# EAGLE design USB_Charger (EAGLE 7.5.0)
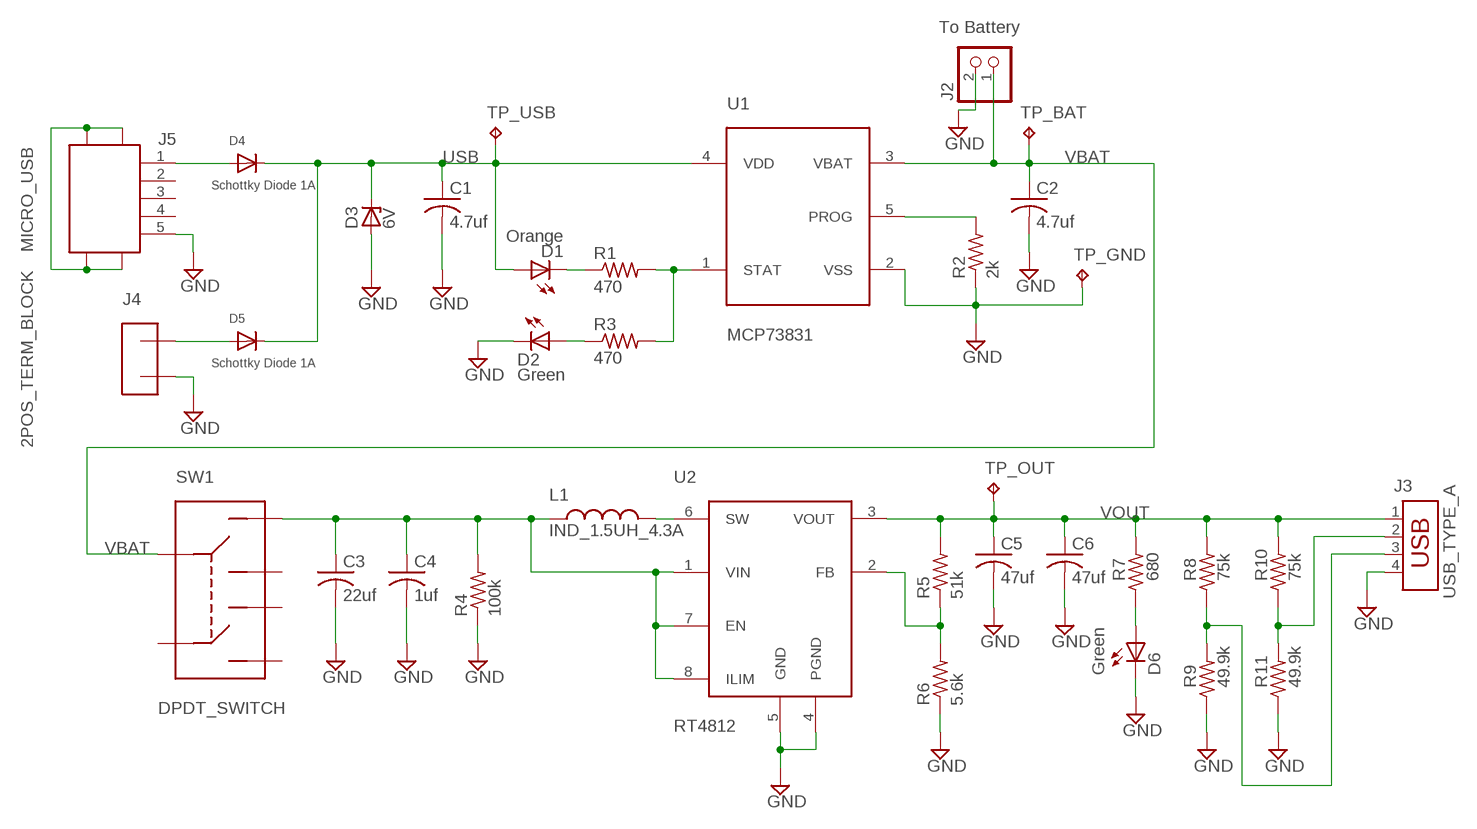
[diagram p0: schematic, sheet 1]

## Parts
C1  4.7uf  C-USC0805  [C0805]
C2  4.7uf  C-USC0805  [C0805]
C3  22uf  C-USC0805  [C0805]
C4  1uf  C-USC0805  [C0805]
C5  47uf  C-USC1210  [C1210]
C6  47uf  C-USC1210  [C1210]
D1  Orange  LEDCHIP-LED0805  [CHIP-LED0805]
D2  Green  LEDCHIP-LED0805  [CHIP-LED0805]
D3  6V  ZENER-DIODESMB  [SMB]
D4  Schottky Diode 1A  DIODESMA  [SMADIODE]
D5  Schottky Diode 1A  DIODESMA  [SMADIODE]
D6  Green  LEDCHIP-LED0805  [CHIP-LED0805]
J2  To Battery  JST_2PIN-THM-RA  [JST-PH-2-THM-RA]
J3  USB_TYPE_A  USB-787616  [USB]
J4  2POS_TERM_BLOCK  [2POS_5.08MM]
J5  MICRO_USB  [MICRO_USB]
L1  IND_1.5UH_4.3A  [IND_SMD]
R1  470  R-US_R0805  [R0805]
R2  2k  R-US_R0805  [R0805]
R3  470  R-US_R0805  [R0805]
R4  100k  R-US_R0805  [R0805]
R5  51k  R-US_R0805  [R0805]
R6  5.6k  R-US_R0805  [R0805]
R7  680  R-US_R0805  [R0805]
R8  75k  R-US_R0805  [R0805]
R9  49.9k  R-US_R0805  [R0805]
R10  75k  R-US_R0805  [R0805]
R11  49.9k  R-US_R0805  [R0805]
SW1  DPDT_SWITCH  [GF-126-0159]
TP_BAT  TPB1,27  [B1,27]
TP_GND  TPB1,27  [B1,27]
TP_OUT  TPB1,27  [B1,27]
TP_USB  TPB1,27  [B1,27]
U1  MCP73831  [SOT-23-5]
U2  RT4812  [TSOT-23-8]

## Nets
GND: C1.2 C2.2 C3.2 C4.2 C5.2 C6.2 D2.C D3.A D6.C J2.2 J3.4 J4.2 J5.5 R2.1 R4.1 R6.1 R9.1 R11.1 TP_GND.TP U1.2(VSS) U2.4(PGND) U2.5(GND)
IND_OUT: L1.2 U2.6(SW)
N$2: R5.1 R6.2 U2.2(FB)
N$3: D1.C R1.1
N$4: R1.2 R3.2 U1.1(STAT)
N$5: R2.2 U1.5(PROG)
N$6: D5.A J4.1
N$7: D2.A R3.1
N$10: D6.A R7.1
N$11: J3.3 R8.1 R9.2
N$12: J3.2 R10.1 R11.2
SW_OUT: C3.1 C4.1 L1.1 R4.2 SW1.1 U2.1(VIN) U2.7(EN) U2.8(ILIM)
USB: C1.1 D1.A D3.C D4.C D5.C TP_USB.TP U1.4(VDD)
USB_IN: D4.A J5.1
USB_SHD: J5.SH1 J5.SH2 J5.SH3 J5.SH4
VBAT: C2.1 J2.1 SW1.2 TP_BAT.TP U1.3(VBAT)
VOUT: C5.1 C6.1 J3.1 R5.2 R7.2 R8.2 R10.2 TP_OUT.TP U2.3(VOUT)
Unconnected: J5.2 J5.3 J5.4 SW1.3 SW1.4 SW1.5 SW1.6

## Library data of the parts
C1-C6 = rcl:C-US: CAPACITOR, American symbol
D1 D2 D6 = led:LED: LED OSRAM: - CHIPLED LG R971, LG N971, LY N971, LG Q971, LY Q971, LO R971, LY R971 LH N974, LH R974 LS Q976, LO Q976, LY Q976 LO Q996 - Hyper CHIPLED LW Q18S LB Q993, LB Q99A, LB R99A - SideLED LS A670, LO A670, LY A670, LG A670, LP A670 LB A673, LV A673, LT A673, LW A673 LH A674 LY A675 LS A676, LA A676, LO A676, LY A676, LW A676 LS A679, LY A679, LG A679 - Hyper Micro SIDELED® LS Y876, LA Y876, LO Y876, LY Y876 LT Y87S - SmartLED LW L88C, LW L88S LB L89C, LB L89S, LG L890 LS L89K, LO L89K, LY L89K LS L896, LA L896, LO L896, LY L896 - TOPLED LS T670, LO T670, LY T670, LG T670, LP T670 LSG T670, LSP T670, LSY T670, LOP T670, LYG T670 LG T671, LOG T671, LSG T671 LB T673, LV T673, LT T673, LW T673 LH T674 LS T676, LA T676, LO T676, LY T676, LB T676, LH T676, LSB T676, LW T676 LB T67C, LV T67C, LT T67C, LS T67K, LO T67K, LY T67K, LW E67C LS E67B, LA E67B, LO E67B, LY E67B, LB E67C, LV E67C, LT E67C LW T67C LS T679, LY T679, LG T679 LS T770, LO T770, LY T770, LG T770, LP T770 LB T773, LV T773, LT T773, LW T773 LH T774 LS E675, LA E675, LY E675, LS T675 LS T776, LA T776, LO T776, LY T776, LB T776 LHGB T686 LT T68C, LB T68C - Hyper Mini TOPLED® LB M676 - Mini TOPLED Santana® LG M470 LS M47K, LO M47K, LY M47K Source: http://www.osram.convergy.de LUXEON: - LUMILED® LXK2-PW12-R00, LXK2-PW12-S00, LXK2-PW14-U00, LXK2-PW14-V00 LXK2-PM12-R00, LXK2-PM12-S00, LXK2-PM14-U00 LXK2-PE12-Q00, LXK2-PE12-R00, LXK2-PE12-S00, LXK2-PE14-T00, LXK2-PE14-U00 LXK2-PB12-K00, LXK2-PB12-L00, LXK2-PB12-M00, LXK2-PB14-N00, LXK2-PB14-P00, LXK2-PB14-Q00 LXK2-PR12-L00, LXK2-PR12-M00, LXK2-PR14-Q00, LXK2-PR14-R00 LXK2-PD12-Q00, LXK2-PD12-R00, LXK2-PD12-S00 LXK2-PH12-R00, LXK2-PH12-S00 LXK2-PL12-P00, LXK2-PL12-Q00, LXK2-PL12-R00 Source: www.luxeon.com KINGBRIGHT: KA-3528ASYC Source: www.kingbright.com
D3 = diode:ZENER-DIODE: Z-Diode
D4 D5 = adafruit:DIODE: Diode SMADIODE - SMA Surface Mount Package 20V 1A Schottky Diode Digikey: 641-1014-6-ND DO-1N4148 - Through Hole Small Current Diode SOD-123 20V 1 A (.5mV Vf) Schottky Diode - Digikey: MBRX120TPMSCT-ND SOD-323 10V 570mA (.38mV Vf, 3ns) Schottky Diode - Digikey: ZLLS410CT-ND SOD-523 30V 30mA Schottky Diode (RB751S-40TE61) - Digikey: RB751S-40TE61CT-ND SOT23-R/W - SOT23 Package (R = Solder Paste/Reflow Ovens, W = Hand-Soldering) BAT54Film 40V 300mA - Digikey: 497-7162-1-ND
J2 = adafruit:JST_2PIN: JST 2-Pin Connectors of various flavors SMT-RA (S2B-PH-SM4) 4UConnector #17311 SMT (B2B-PH-SM4) THM-RA (S2B-PH) THM (B2B-PH)
J3 = con-amp:USB-787616: AMP connector
J4 = USB_Charger:2POS_TERM_BLOCK: Digikey Part# ED1817-ND, Female Connector Part# ED2908-ND
J5 = USB_Charger:MICRO_USB: Digikey Part# 609-4618-1-ND
L1 = USB_Charger:IND_1.5UH_4.3A: Digikey Part# 732-5514-1-ND
R1-R11 = rcl:R-US_: RESISTOR, American symbol
SW1 = USB_Charger:DPDT_SWITCH
TP_BAT TP_GND TP_OUT TP_USB = testpad:TP: Test pad
U1 = USB_Charger:MCP73831
U2 = USB_Charger:RT4812: Digikey Part# RT4812GJ8FCT-ND

## Board
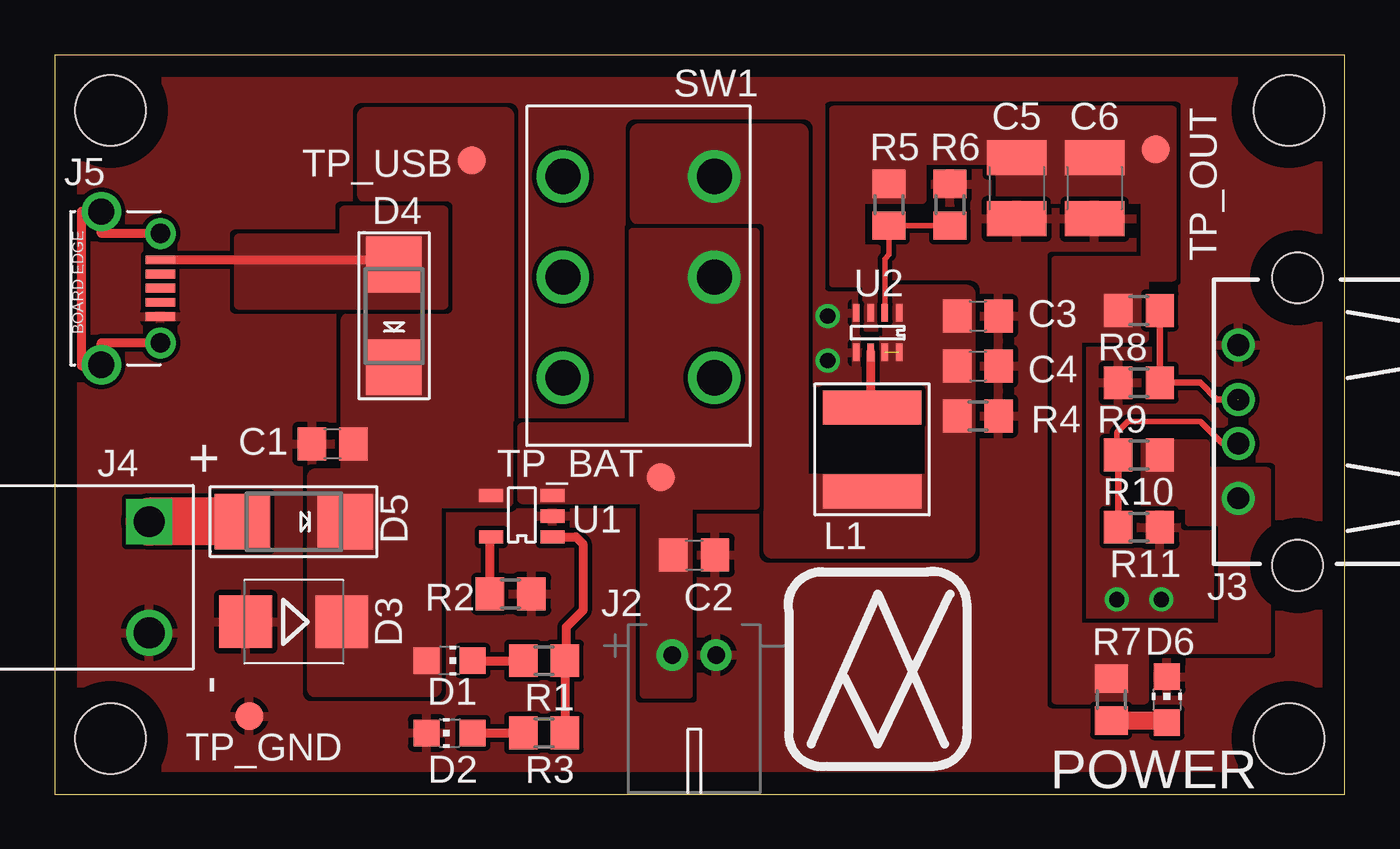
[diagram p1: board, top side]
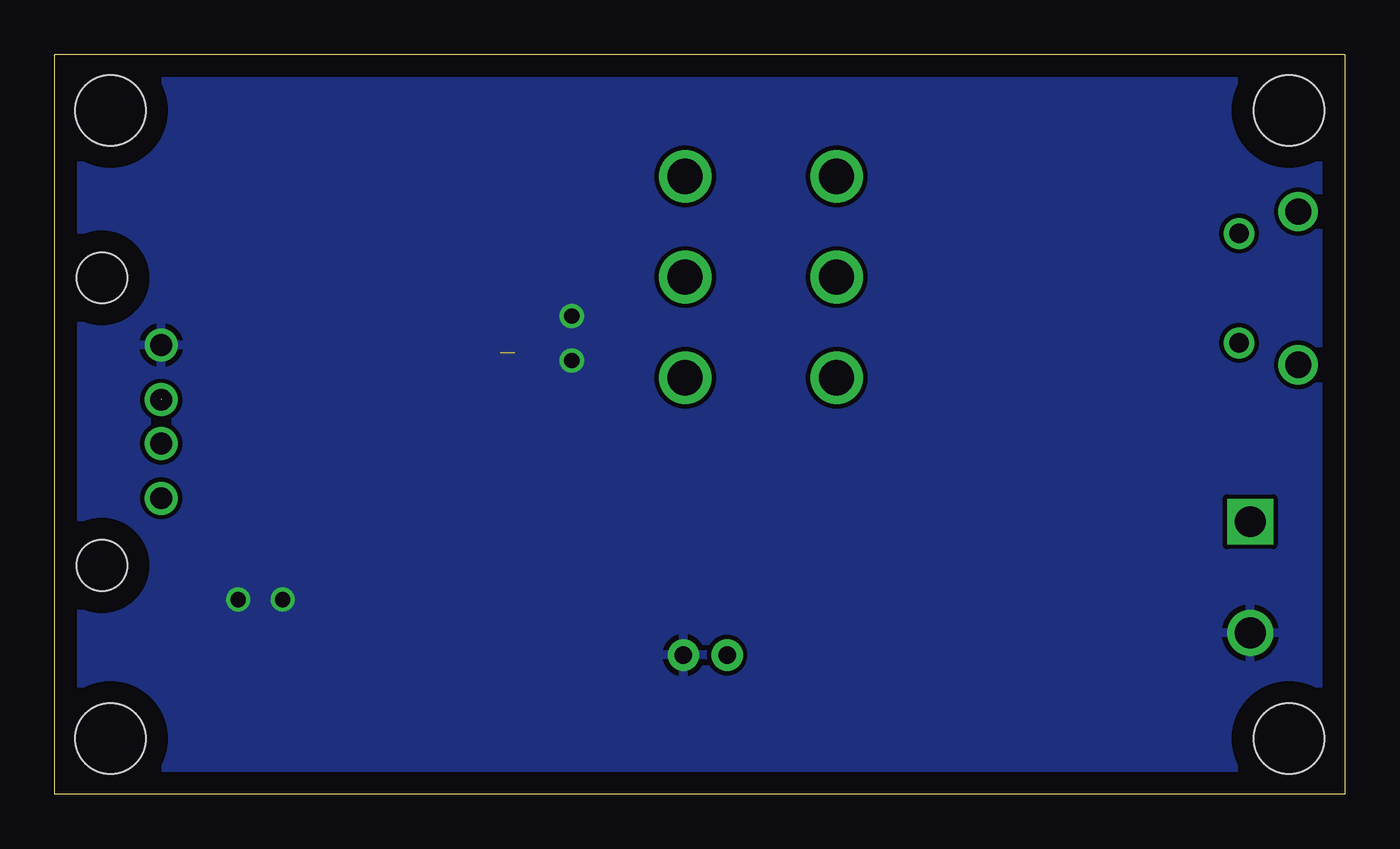
[diagram p2: board, bottom side, seen from below]

Size 58.93 x 33.78 mm. Coordinates in mm from the lower left corner, seen from the top.
Outline: 0,33.77 0,0 58.93,0 58.93,33.78 0,33.78
Copper layers (1*16): Top 0.035mm / dielectric 1.5mm / Bottom 0.035mm
Design rules "default": minimum track width 10mil, minimum drill 24mil, track to track 8mil, track to pad 8mil, pad to pad 8mil, via to via 8mil, smd to smd 8mil, copper to edge 40mil, drill to drill 8mil, minimum pad ring 10mil, minimum via ring 8mil, stop-mask expansion 4mil, vias tented up to drill 0mil, thermal gap 10mil
Holes 3.2 mm at 2.54,31.24 2.54,2.54 56.39,2.54 56.39,31.24

### Footprints (pad centres in the part's own frame; a part is rotated, then mirrored left to right if it is on the bottom)
C0805 = smd 1.3 x 1.5: 1 -0.95,0; 2 0.95,0
C1210 = smd 1.6 x 2.7: 1 -1.4,0; 2 1.4,0
CHIP-LED0805 = smd 1.2 x 1.2: A 0,-1.05; C 0,1.05
SMB = smd 2.4 x 2.4: A 2.2,0; C -2.2,0
SMADIODE = smd 2.54 x 2.54: A 2.349,0; C -2.349,0
JST-PH-2-THM-RA = drill 0.8 pad 1.422: 1 1,0; 2 -1,0
USB = drill 1: 1 -3.5,12.99; 2 -1,12.99; 3 1,12.99; 4 3.5,12.99 | hole 2.3: -6.57,10.28; 6.57,10.28
2POS_5.08MM = drill 1.4 square: 1 0,2.54 | drill 1.4: 2 0,-2.54
MICRO_USB = smd 1.35 x 0.4: 1 0,1.3; 2 0,0.65; 3 0,0; 4 0,-0.65; 5 0,-1.3 | drill 1.2: SH1 -2.7,3.5; SH3 -2.7,-3.5 | drill 0.9: SH2 0,2.5; SH4 0,-2.5
IND_SMD = smd 1.55 x 4.5: 1 -1.925,0; 2 1.925,0
R0805 = smd 1.3 x 1.5: 1 -0.95,0; 2 0.95,0
GF-126-0159 = drill 1.6: 1 4.6,-3.46; 2 0,-3.46; 3 -4.6,-3.46; 4 4.6,3.46; 5 0,3.46; 6 -4.6,3.46
B1,27 = smd 1.27 x 1.27: TP 0,0
SOT-23-5 = smd 0.6 x 1.1: 1 -0.95,-1.4; 2 0,-1.4; 3 0.95,-1.4; 4 0.95,1.4; 5 -0.95,1.4
TSOT-23-8 = smd 0.3 x 0.8: 1 -0.975,-0.9; 2 -0.325,-0.9; 3 0.325,-0.9; 4 0.975,-0.9; 5 0.975,0.9; 6 0.325,0.9; 7 -0.325,0.9; 8 -0.975,0.9

### Placement (x,y rotation side)
C1  12.7,16 180 top
C2  29.21,10.92 0 top
C3  42.16,21.84 0 top
C4  42.16,19.56 0 top
C5  43.94,27.69 270 top
C6  47.5,27.69 270 top
D1  18.03,6.1 270 top
D2  18.03,2.79 90 top
D3  10.92,7.87 180 top
D4  15.49,21.84 90 top
D5  10.92,12.45 180 top
D6  50.8,4.32 0 top
J2  29.21,6.35 180 top
J3  67.06,17.02 90 top
J4  4.32,9.91 0 top
J5  4.83,23.11 0 top
L1  37.34,15.75 90 top
R1  22.35,6.1 0 top
R2  20.83,9.14 180 top
R3  22.35,2.79 0 top
R4  42.16,17.27 180 top
R5  38.1,26.92 90 top
R6  40.89,26.92 270 top
R7  48.26,4.32 90 top
R8  49.53,22.1 180 top
R9  49.53,18.8 0 top
R10  49.53,15.49 0 top
R11  49.53,12.19 180 top
SW1  26.67,23.62 90 top
TP_BAT  27.69,14.48 0 top
TP_GND  8.89,3.56 0 top
TP_OUT  50.29,29.46 0 top
TP_USB  19.05,28.96 90 top
U1  21.34,12.7 90 top
U2  37.59,21.08 180 top

### Tracks (layer width: path | path; a pad name or v marks a point on that pad's centre or on a via)
GND  (via drill 0.7)
  other vias: 48.51,8.89 35.31,19.81 35.31,21.84 50.55,8.89
  pour Bottom: 0,33.78 58.93,33.78 58.93,0 0,0
  pour Top (rank 6): 0,33.78 58.93,33.78 58.93,0 0,0
IND_OUT
  Top 0.406: U2.6 37.27,17.74
  Top 0.61: 36.76,17.74 L1.2 37.27,17.74
N$2
  Top 0.254: U2.2 37.92,24.45 38.1,24.64 R5.1 R6.2
N$3
  Top 0.406: D1.C R1.1
N$4
  Top 0.406: R3.2 R1.2 23.37,6.67 23.37,7.62 24.13,8.38 24.13,11.43 23.81,11.75 U1.1
N$5
  Top 0.406: R2.2 19.88,11.69 U1.5
N$6
  Top 2.184: D5.A J4.1
N$7
  Top 0.406: D2.A R3.1
N$10
  Top 0.813: R7.1 50.7,3.37 D6.A
N$11  (1 unrouted)
  Top 0.305: R8.1 R9.2 52.32,18.8 53.09,18.03 54.05,18.03
N$12
  Top 0.254: J3.2 53.32,16.02 52.32,17.02 49.02,17.02 48.51,16.51 48.51,15.56 R10.1
  Top 0.305: R11.2 R10.1
SW_OUT  (1 unrouted)
  pour Top (rank 5, no thermals): 26.67,30.23 26.67,26.42 32.77,26.42 32.77,11.18 41.66,11.18 41.66,22.86 37.59,22.86 37.59,19.05 40.13,19.05 40.13,14.22 34.04,14.22 34.04,30.23
USB
  pour Top (rank 4, no thermals): 14.22,30.99 20.57,30.99 20.57,13.46 17.27,13.46 17.27,4.83 11.94,4.83 11.94,14.48 13.46,14.48 13.46,21.59 17.78,21.59 17.78,27.43 14.22,27.43
USB_IN
  Top 0.406: J5.1 15.49,24.41 D4.A
  Top 0.61: 15.49,24.46 D4.A
  Top 0.813: D4.A 15.23,24.46
  pour Top (rank 2, no thermals): 8.38,22.35 17.78,22.35 17.78,26.67 13.21,26.67 13.21,25.4 8.38,25.4
USB_SHD
  Top 0.406: J5.SH4 2.13,20.61 J5.SH3 2.13,19.56 1.22,19.56 1.22,26.61 J5.SH1 2.13,25.61 J5.SH2
VBAT
  Top 0.813: 28.21,10.72 C2.1 28.21,10.87
  pour Top (rank 3, no thermals): 28.96,4.57 28.96,13.21 32,13.21 32,25.65 26.42,25.65 26.42,16.76 21.34,16.76 21.34,13.46 26.92,13.46 26.92,4.57
VOUT
  pour Top (no thermals): 37.59,21.34 37.59,24.89 36.83,24.89 36.83,27.18 39.62,27.18 39.62,28.96 43.18,28.96 43.18,27.18 49.78,27.18 49.78,24.38 45.72,24.38 45.72,4.32 49.78,4.32 49.78,6.6 55.37,6.6 55.37,14.73 52.58,14.73 52.58,16 49.78,16 49.78,13.21 51.82,13.21 51.82,12.45 53.34,12.45 53.34,7.62 46.74,7.62 46.74,20.83 49.78,20.83 49.78,23.62 51.05,23.62 51.05,31.24 35.56,31.24 35.56,23.37 37.08,23.37 37.08,21.34

### Text on the board
_tsilk: + | - | POWER